# Altium schematic sheet TheConductorChildBoardV2.SchDoc
size Letter; SheetNumber: 1; SheetTotal: 1
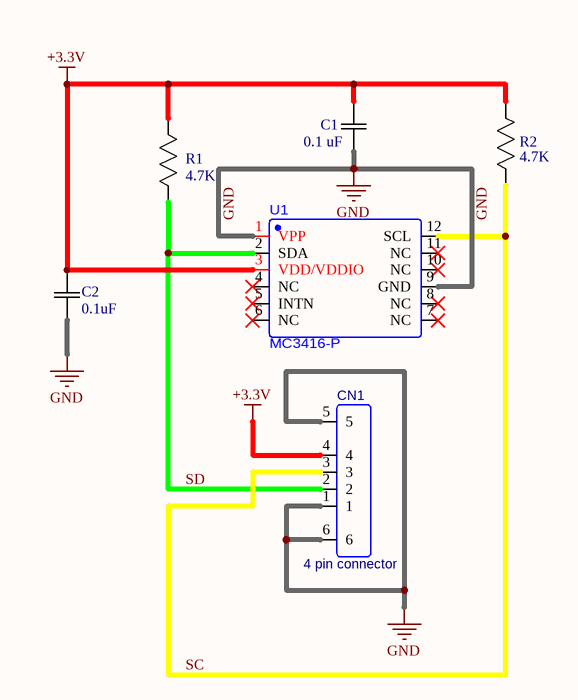
[diagram p0: TheConductorChildBoardV2.SchDoc]

## Parts
C1  0.1 uF  [CAP_AMK107BJ475MK-T_TAY]
C2  0.1uF  [CAP_AMK107BJ475MK-T_TAY]
CN1  4 pin connector  [CONN-SMD_4P-P1.00_SM04B-SRSS-TB-LF-SN - duplicate]
R1  4.7K  [RC0603N_YAG]
R2  4.7K  [RC0603N_YAG]
U1  MC3416-P  [LGA-12_L2.0-W2.0-P0.50-BL - duplicate]

## Nets
+3.3V: C1.2 C2.1 CN1.4 R1.1 R2.1 U1.3(VDD/VDDIO)
GND: C1.1 C2.2 CN1.1 CN1.5 CN1.6 U1.1(VPP) U1.9(GND)
SC: CN1.3 R2.2 U1.12(SCL)
SD: CN1.2 R1.2 U1.2(SDA)

Not connected (* = marked no-connect by the designer): U1 4(NC)* 5(INTN)* 6(NC)* 7(NC)* 8(NC)* 10(NC)* 11(NC)*

## Library data of the parts
C1 C2 = CL10B104KB8NNNC: SMT Capacitor 0.1 uF; Mfr_Name: Taiyo Yuden; Manufacturer_Part_Number: AMK107BJ475MK-T; Type: DEV; Copyright: Copyright (C) 2023 Ultra Librarian. All rights reserved.; Digi-Key_Part_Number_1: 587-2228-1-ND; Digi-Key_Part_Number_2: 587-2228-2-ND; Digi-Key_Part_Number_3: 587-2228-6-ND; RefDes: RefDes; LCSC PART #: C1591
CN1 = SM04B-SRSS-TB (LF)(SN): Manufacturer: JST; Contributor: LCSC; Supplier: LCSC; Supplier Part: C160404; Manufacturer Part: SM04B-SRSS-TB(LF)(SN); JLCPCB Part Class: Extended Part; spicePre: C; spiceSymbolName: SM04B-SRSS-TB (LF)(SN); LCSC PART #: C160404
R1 R2 = RC0603JR-074K7L: SMT Resitor 4.7k; Mfr_Name: Yageo; Manufacturer_Part_Number: RC0603JR-072K7L; Copyright: Copyright (C) 2023 Ultra Librarian. All rights reserved.; Digi-Key_Part_Number_1: 311-2.7KGRCT-ND; Digi-Key_Part_Number_2: 311-2.7KGRDKR-ND; Digi-Key_Part_Number_3: 311-2.7KGRTR-ND; Digi-Key_Part_Number_4: 311-2.7KGRTR-NDL; RefDes: RefDes; Type: DEV; LCSC PART #: C105428
U1 = MC3416-P: VLGA-12 Attitude Sensor/Gyroscope ROHS; LCSC PART #: C5250287